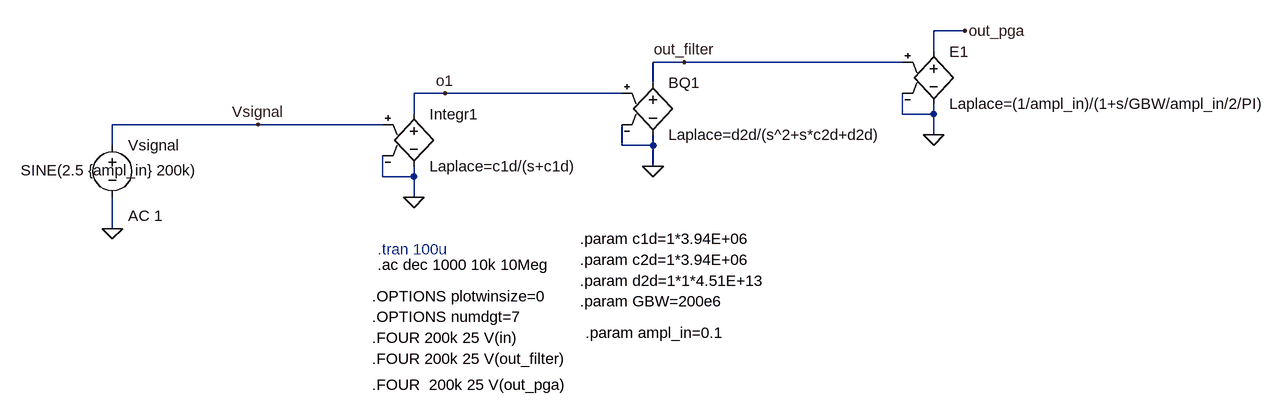
[diagram p0: schematic model_interfata.asc]
model_interfata.asc, the LTspice schematic file:
Version 4
SHEET 1 2872 1736
WIRE 2320 272 2272 272
WIRE 2272 304 2272 272
WIRE 1888 320 1840 320
WIRE 2224 320 1888 320
WIRE 1840 352 1840 320
WIRE 1520 368 1472 368
WIRE 1792 368 1520 368
WIRE 1472 400 1472 368
WIRE 2224 400 2224 368
WIRE 2272 400 2272 384
WIRE 2272 400 2224 400
WIRE 1232 416 1008 416
WIRE 1424 416 1232 416
WIRE 2272 432 2272 400
WIRE 1008 448 1008 416
WIRE 1792 448 1792 416
WIRE 1840 448 1840 432
WIRE 1840 448 1792 448
WIRE 1840 480 1840 448
WIRE 1424 496 1424 464
WIRE 1472 496 1472 480
WIRE 1472 496 1424 496
WIRE 1472 528 1472 496
WIRE 1008 576 1008 528
FLAG 1008 576 0
FLAG 1472 528 0
FLAG 1520 368 o1
FLAG 1840 480 0
FLAG 1888 320 out_filter
FLAG 1232 416 Vsignal
FLAG 2272 432 0
FLAG 2320 272 out_pga
SYMBOL voltage 1008 432 R0
WINDOW 123 24 124 Left 2
WINDOW 39 0 0 Left 0
WINDOW 3 -141 54 Left 2
SYMATTR Value2 AC 1
SYMATTR Value SINE(2.5 {ampl_in} 200k)
SYMATTR InstName Vsignal
SYMBOL e 1472 384 R0
SYMATTR InstName Integr1
SYMATTR Value Laplace=c1d/(s+c1d)
SYMBOL e 1840 336 R0
SYMATTR InstName BQ1
SYMATTR Value Laplace=d2d/(s^2+s*c2d+d2d)
SYMBOL e 2272 288 R0
SYMATTR InstName E1
SYMATTR Value Laplace=(1/ampl_in)/(1+s/GBW/ampl_in/2/PI)
TEXT 1416 632 Left 2 !.ac dec 1000 10k 10Meg
TEXT 1728 592 Left 2 !.param c1d=1*3.94E+06
TEXT 1728 624 Left 2 !.param c2d=1*3.94E+06
TEXT 1728 656 Left 2 !.param d2d=1*1*4.51E+13
TEXT 1416 608 Left 2 ;.tran 100u
TEXT 1408 744 Left 2 !.FOUR 200k 25 V(in)
TEXT 1408 680 Left 2 !.OPTIONS plotwinsize=0
TEXT 1408 712 Left 2 !.OPTIONS numdgt=7
TEXT 1408 776 Left 2 !.FOUR 200k 25 V(out_filter)
TEXT 1736 736 Left 2 !.param ampl_in=0.1
TEXT 1408 816 Left 2 !.FOUR  200k 25 V(out_pga)
TEXT 1728 688 Left 2 !.param GBW=200e6

The netlist it stands for:
* model_interfata.asc
Vsignal Vsignal 0 SINE(2.5 {ampl_in} 200k) AC 1
E§Integr1 o1 0 Vsignal 0 Laplace=c1d/(s+c1d)
E§BQ1 out_filter 0 o1 0 Laplace=d2d/(s^2+s*c2d+d2d)
E1 out_pga 0 out_filter 0 Laplace=(1/ampl_in)/(1+s/GBW/ampl_in/2/PI)
.ac dec 1000 10k 10Meg
.param c1d=1*3.94E+06
.param c2d=1*3.94E+06
.param d2d=1*1*4.51E+13
* .tran 100u
.FOUR 200k 25 V(in)
.OPTIONS plotwinsize=0
.OPTIONS numdgt=7
.FOUR 200k 25 V(out_filter)
.param ampl_in=0.1
.FOUR  200k 25 V(out_pga)
.param GBW=200e6
.backanno
.end